# Altium schematic sheet HEATER.SchDoc
size 420 x 297 mm; SheetNumber: 15; SheetTotal: 21
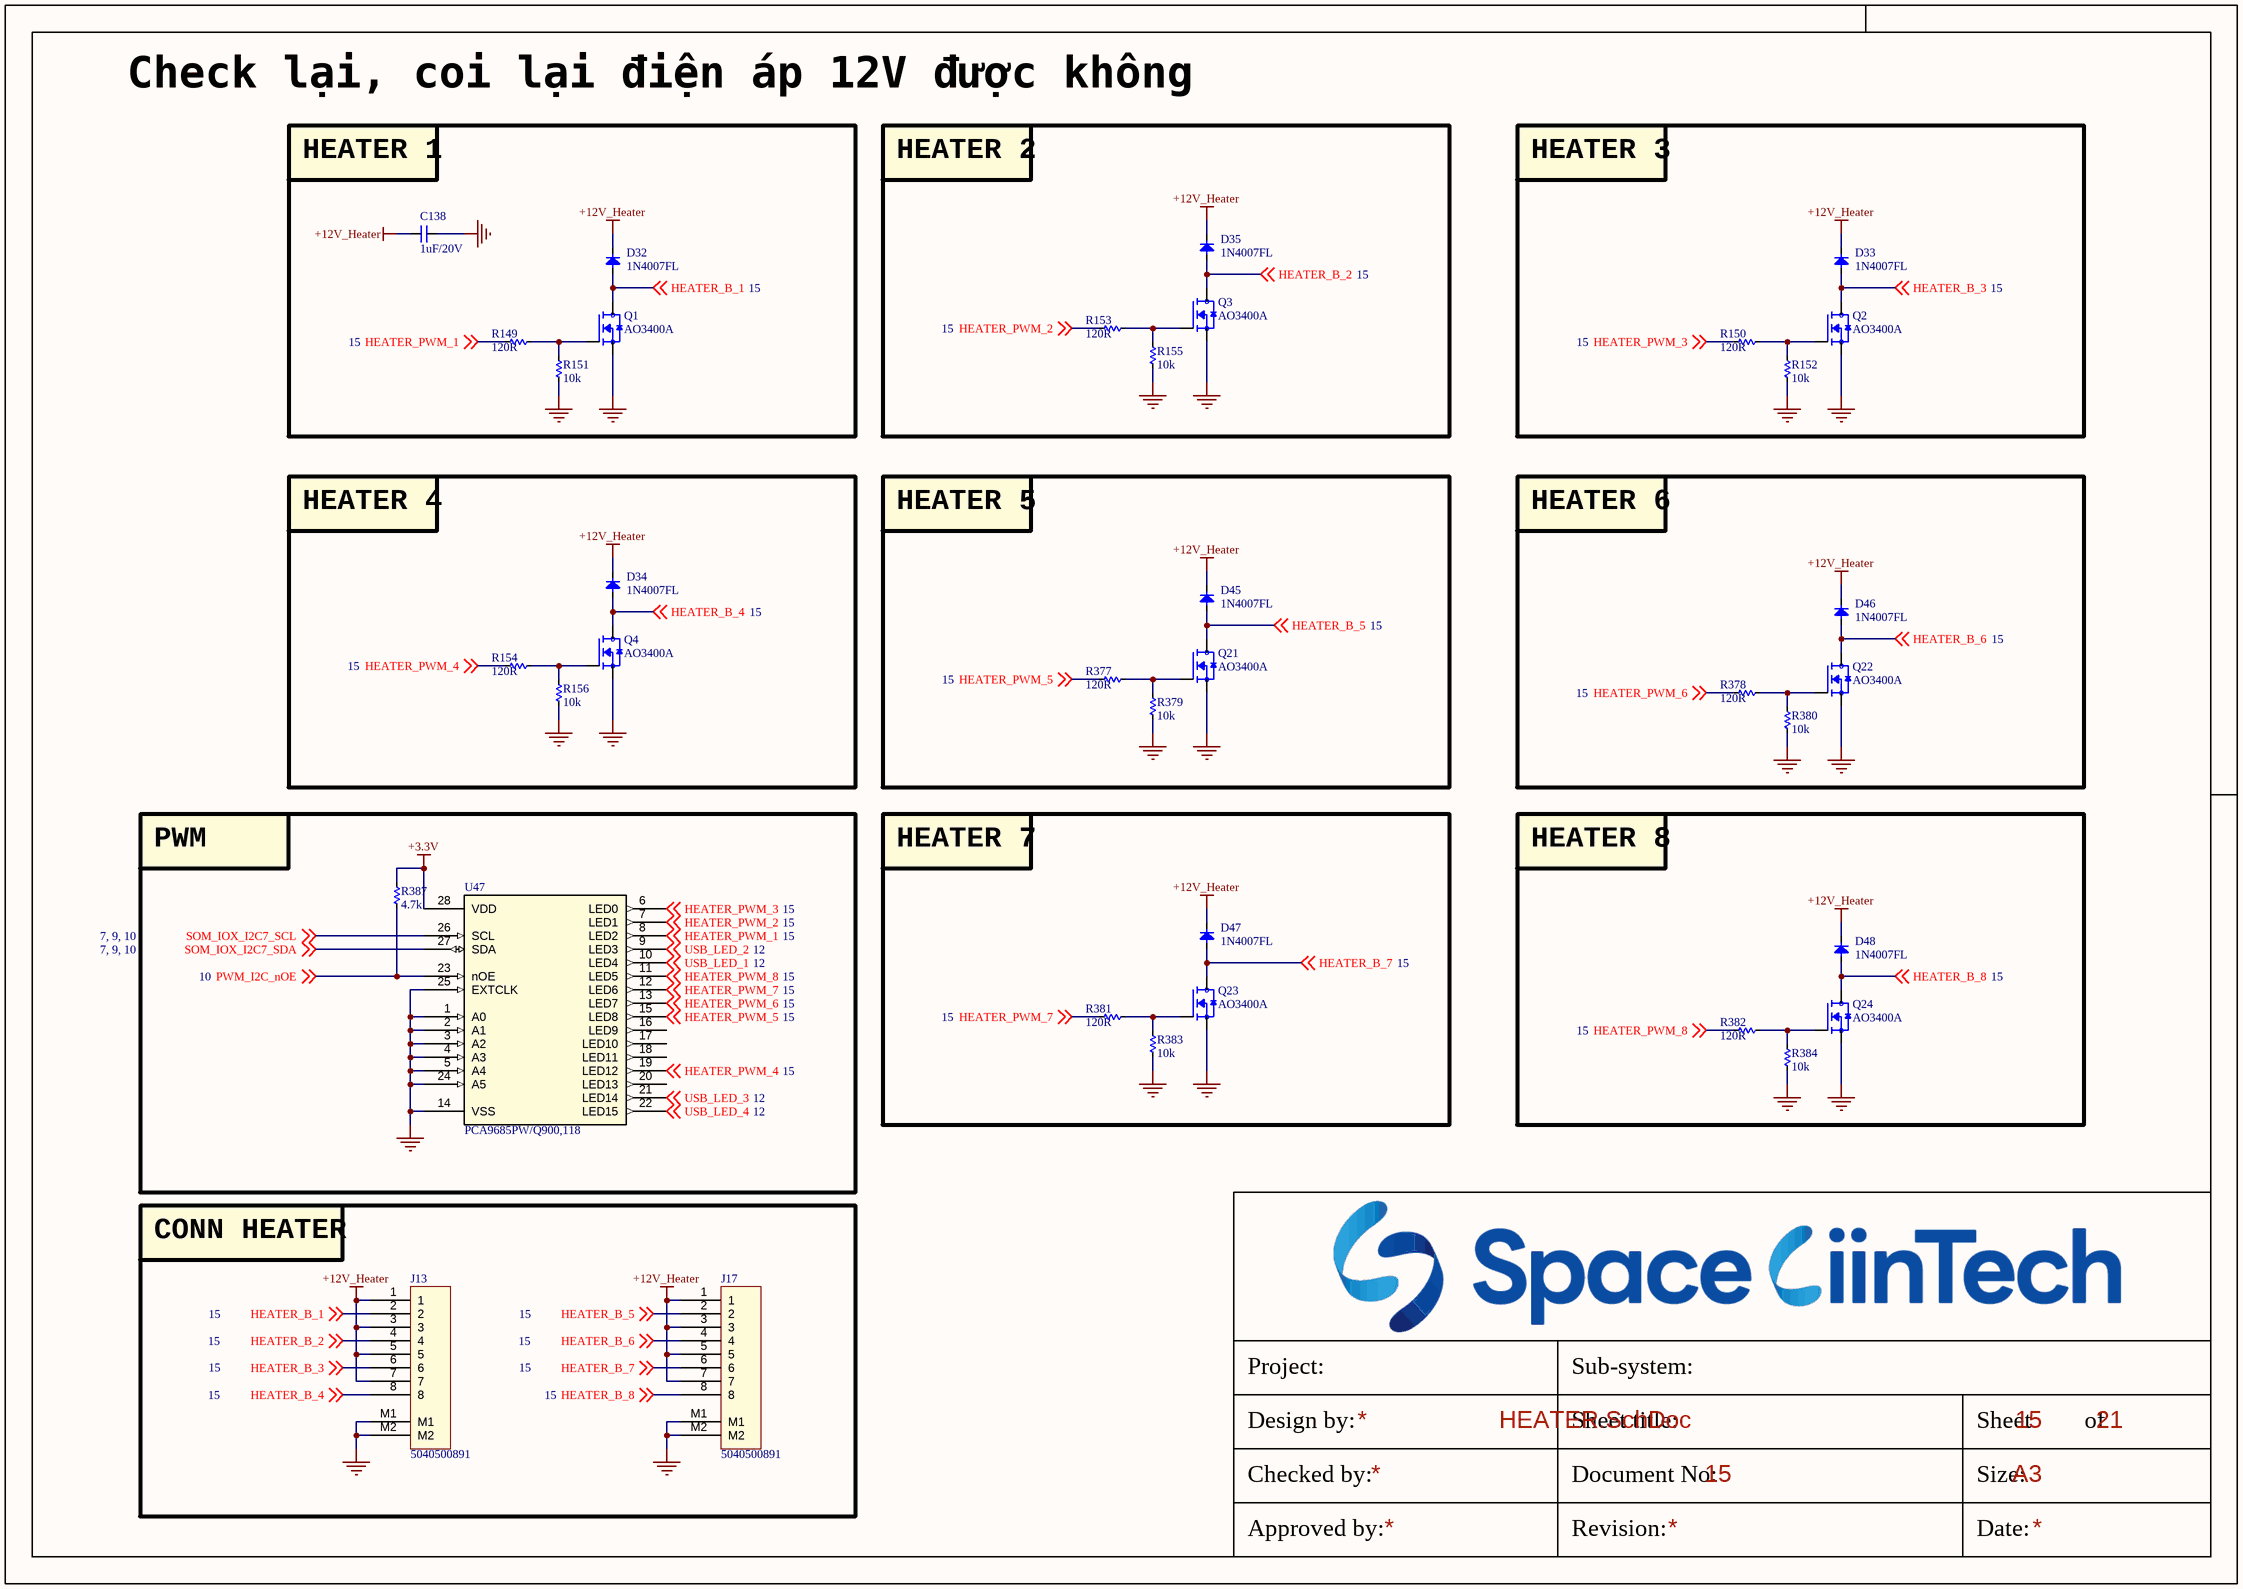
[diagram p0: HEATER.SchDoc]

## Parts
C138  1uF/20V  [CAP_C_1005X60]
D32  1N4007FL  [SOD3717X145N]
D33  1N4007FL  [SOD3717X145N]
D34  1N4007FL  [SOD3717X145N]
D35  1N4007FL  [SOD3717X145N]
D45  1N4007FL  [SOD3717X145N]
D46  1N4007FL  [SOD3717X145N]
D47  1N4007FL  [SOD3717X145N]
D48  1N4007FL  [SOD3717X145N]
J13  5040500891  [MOLEX_5040500891]
J17  5040500891  [MOLEX_5040500891]
Q1  AO3400A  [SOT95P240X120-3N]
Q2  AO3400A  [SOT95P240X120-3N]
Q3  AO3400A  [SOT95P240X120-3N]
Q4  AO3400A  [SOT95P240X120-3N]
Q21  AO3400A  [SOT95P240X120-3N]
Q22  AO3400A  [SOT95P240X120-3N]
Q23  AO3400A  [SOT95P240X120-3N]
Q24  AO3400A  [SOT95P240X120-3N]
R149  120R  [RES_C_1005X40]
R150  120R  [RES_C_1005X40]
R151  10k  [RES_C_1005X40]
R152  10k  [RES_C_1005X40]
R153  120R  [RES_C_1005X40]
R154  120R  [RES_C_1005X40]
R155  10k  [RES_C_1005X40]
R156  10k  [RES_C_1005X40]
R377  120R  [RES_C_1005X40]
R378  120R  [RES_C_1005X40]
R379  10k  [RES_C_1005X40]
R380  10k  [RES_C_1005X40]
R381  120R  [RES_C_1005X40]
R382  120R  [RES_C_1005X40]
R383  10k  [RES_C_1005X40]
R384  10k  [RES_C_1005X40]
R387  4.7k  [RES_C_1005X40]
U47  PCA9685PW/Q900,118  [TSSOP28_SOT361-1_NXP]

## Blocks framed on the sheet
HEATER 1: C138 D32 Q1 R149 R151
HEATER 2: D35 Q3 R153 R155
HEATER 3: D33 Q2 R150 R152
HEATER 4: D34 Q4 R154 R156
HEATER 5: D45 Q21 R377 R379
HEATER 6: D46 Q22 R378 R380
PWM: R387 U47
HEATER 7: D47 Q23 R381 R383
HEATER 8: D48 Q24 R382 R384
CONN HEATER: J13 J17

## Nets
+3.3V: R387.2 U47.28(VDD)
+12V_Heater: C138.2 D32.1(K) D33.1(K) D34.1(K) D35.1(K) D45.1(K) D46.1(K) D47.1(K) D48.1(K) J13.1 J13.3 J13.5 J13.7 J17.1 J17.3 J17.5 J17.7
GND: C138.1 J13.M1 J13.M2 J17.M1 J17.M2 Q1.2(S) Q2.2(S) Q3.2(S) Q4.2(S) Q21.2(S) Q22.2(S) Q23.2(S) Q24.2(S) R151.1 R152.1 R155.1 R156.1 R379.1 R380.1 R383.1 R384.1 U47.1(A0) U47.2(A1) U47.3(A2) U47.4(A3) U47.5(A4) U47.14(VSS) U47.24(A5) U47.25(EXTCLK)
HEATER_B_1: D32.2(A) J13.2 Q1.3(D) ; off-sheet HEATER_B_1
HEATER_B_2: D35.2(A) J13.4 Q3.3(D) ; off-sheet HEATER_B_2
HEATER_B_3: D33.2(A) J13.6 Q2.3(D) ; off-sheet HEATER_B_3
HEATER_B_4: D34.2(A) J13.8 Q4.3(D) ; off-sheet HEATER_B_4
HEATER_B_5: D45.2(A) J17.2 Q21.3(D) ; off-sheet HEATER_B_5
HEATER_B_6: D46.2(A) J17.4 Q22.3(D) ; off-sheet HEATER_B_6
HEATER_B_7: D47.2(A) J17.6 Q23.3(D) ; off-sheet HEATER_B_7
HEATER_B_8: D48.2(A) J17.8 Q24.3(D) ; off-sheet HEATER_B_8
HEATER_PWM_1: R149.1 U47.8(LED2) ; off-sheet HEATER_PWM_1
HEATER_PWM_2: R153.1 U47.7(LED1) ; off-sheet HEATER_PWM_2
HEATER_PWM_3: R150.1 U47.6(LED0) ; off-sheet HEATER_PWM_3
HEATER_PWM_4: R154.1 U47.19(LED12) ; off-sheet HEATER_PWM_4
HEATER_PWM_5: R377.1 U47.15(LED8) ; off-sheet HEATER_PWM_5
HEATER_PWM_6: R378.1 U47.13(LED7) ; off-sheet HEATER_PWM_6
HEATER_PWM_7: R381.1 U47.12(LED6) ; off-sheet HEATER_PWM_7
HEATER_PWM_8: R382.1 U47.11(LED5) ; off-sheet HEATER_PWM_8
PWM_I2C_nOE: R387.1 U47.23(nOE) ; off-sheet PWM_I2C_nOE
SOM_IOX_I2C7_SCL: U47.26(SCL) ; off-sheet SOM_IOX_I2C7_SCL
SOM_IOX_I2C7_SDA: U47.27(SDA) ; off-sheet SOM_IOX_I2C7_SDA
USB_LED_1: U47.10(LED4) ; off-sheet USB_LED_1
USB_LED_2: U47.9(LED3) ; off-sheet USB_LED_2
USB_LED_3: U47.21(LED14) ; off-sheet USB_LED_3
USB_LED_4: U47.22(LED15) ; off-sheet USB_LED_4
NetQ1_1: Q1.1(G) R149.2 R151.2
NetQ2_1: Q2.1(G) R150.2 R152.2
NetQ3_1: Q3.1(G) R153.2 R155.2
NetQ4_1: Q4.1(G) R154.2 R156.2
NetQ21_1: Q21.1(G) R377.2 R379.2
NetQ22_1: Q22.1(G) R378.2 R380.2
NetQ23_1: Q23.1(G) R381.2 R383.2
NetQ24_1: Q24.1(G) R382.2 R384.2

Not connected (* = marked no-connect by the designer): U47 16(LED9) 17(LED10) 18(LED11) 20(LED13)

## Notes on the sheet
- Check lại, coi lại điện áp 12V được không
- Project:
- Sub-system:
- Design by:
- Sheet title:
- Sheet
- of
- Checked by:
- Approved by:
- Revision:
- Document No:
- Size:
- Date:
- A3

## Library data of the parts
C138 = _CAP_C_2: CAP CHIP
D32-D35 D45-D48 = Diode SMD: Default Diode; Code - JEDEC: DO-214-AB; Value: 1N5007; Published: 8-Jun-2000; Revision: July-2002: Re-released for DXP Platform.; Publisher: Altium Limited
J13 J17 = Header 8x1_2M
Q1-Q4 Q21-Q24 = MOSFET_N: N-Channel 30 V 5.7A (Ta) 1.4W (Ta) Surface Mount SOT-23-3; MF: Alpha & Omega Semiconductor; SnapEDA_Link: https://www.snapeda.com/parts/AO3400A/Alpha/view-part/?ref=snap; Package: SOT-23 Alpha &amp; Omega Semiconductor Inc.; Value: *; MP: AO3400A; Check_prices: https://www.snapeda.com/parts/AO3400A/Alpha/view-part/?ref=eda
R149-R156 R377-R384 R387 = _RES_B_2: RES
U47 = IC_PWM_PCA9685PW/Q900,118: No Description Available; Manufacturer_Name: NXP; Copyright: Copyright (C) 2025 Ultra Librarian. All rights reserved.; Manufacturer_Part_Number: PCA9685PW/Q900,118; RefDes: RefDes; Type: Type